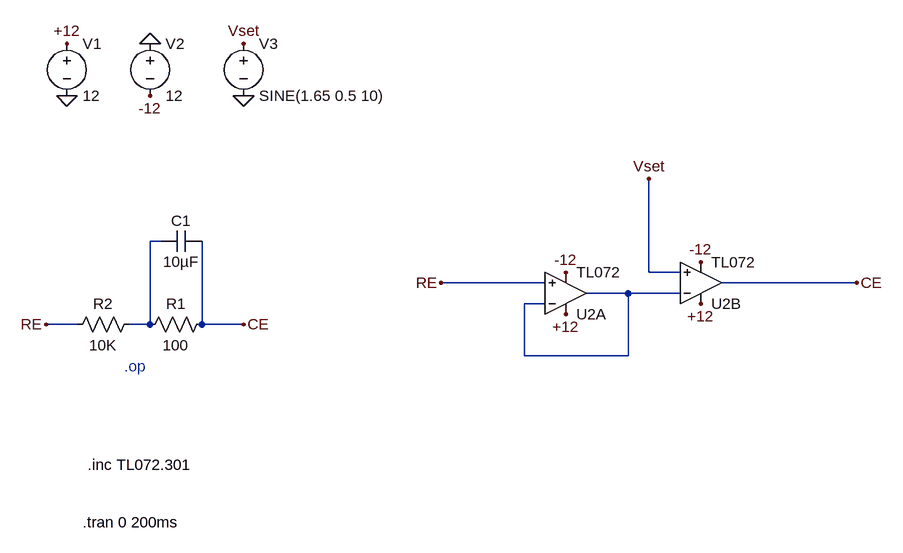
[diagram p0: schematic Control_Loop_tran.asc]
Control_Loop_tran.asc, the LTspice schematic file:
Version 4.1
SHEET 1 880 680
WIRE -400 112 -416 112
WIRE 352 160 352 16
WIRE 400 160 352 160
WIRE 192 176 32 176
WIRE 672 176 464 176
WIRE 320 192 256 192
WIRE 400 192 320 192
WIRE 192 208 160 208
WIRE -528 240 -576 240
WIRE -416 240 -416 112
WIRE -416 240 -448 240
WIRE -336 240 -336 112
WIRE -272 240 -336 240
WIRE 160 288 160 208
WIRE 320 288 320 192
WIRE 320 288 160 288
FLAG -544 -192 +12
FLAG 224 224 +12
FLAG 432 208 +12
FLAG -416 -112 -12
FLAG -272 -192 Vset
FLAG 352 16 Vset
FLAG 224 160 -12
FLAG 432 144 -12
FLAG -272 -112 0
FLAG -416 -192 0
FLAG -544 -112 0
FLAG 32 176 RE
FLAG 672 176 CE
FLAG -576 240 RE
FLAG -272 240 CE
SYMBOL OpAmps\\opamp2 224 256 M180
SYMATTR InstName U2A
SYMATTR Value TL072
SYMBOL OpAmps\\opamp2 432 240 M180
SYMATTR InstName U2B
SYMATTR Value TL072
SYMBOL voltage -544 -208 R0
WINDOW 123 0 0 Left 0
WINDOW 39 0 0 Left 0
SYMATTR InstName V1
SYMATTR Value 12
SYMBOL voltage -416 -208 R0
WINDOW 123 0 0 Left 0
WINDOW 39 0 0 Left 0
SYMATTR InstName V2
SYMATTR Value 12
SYMBOL voltage -272 -208 R0
WINDOW 123 0 0 Left 0
WINDOW 39 0 0 Left 0
SYMATTR InstName V3
SYMATTR Value SINE(1.65 0.5 10)
SYMBOL res -320 224 R90
WINDOW 0 0 56 VBottom 2
WINDOW 3 32 56 VTop 2
SYMATTR InstName R1
SYMATTR Value 100
SYMBOL cap -336 96 R90
WINDOW 0 0 32 VBottom 2
WINDOW 3 32 32 VTop 2
SYMATTR InstName C1
SYMATTR Value 10µF
SYMBOL res -432 224 R90
WINDOW 0 0 56 VBottom 2
WINDOW 3 32 56 VTop 2
SYMATTR InstName R2
SYMATTR Value 10K
TEXT -512 456 Left 2 !.inc TL072.301
TEXT -456 304 Left 2 ;.op
TEXT -520 544 Left 2 !.tran 0 200ms

The netlist it stands for:
* Control_Loop_tran.asc
X§U2A RE N002 +12 -12 N002 TL072  ; pins In+ In- V+ V- OUT
X§U2B Vset N002 +12 -12 CE TL072  ; pins In+ In- V+ V- OUT
V1 +12 0 12
V2 0 -12 12
V3 Vset 0 SINE(1.65 0.5 10)
R1 CE N001 100
C1 CE N001 10µF
R2 N001 RE 10K
.inc TL072.301
* .op
.tran 0 200ms
.backanno
.end